# Altium project nnts.PrjPcb (part 3 of 3)

## Sheet Ethernet_PHY.SchDoc: Ethernet PHY
size A4; Revision: 1
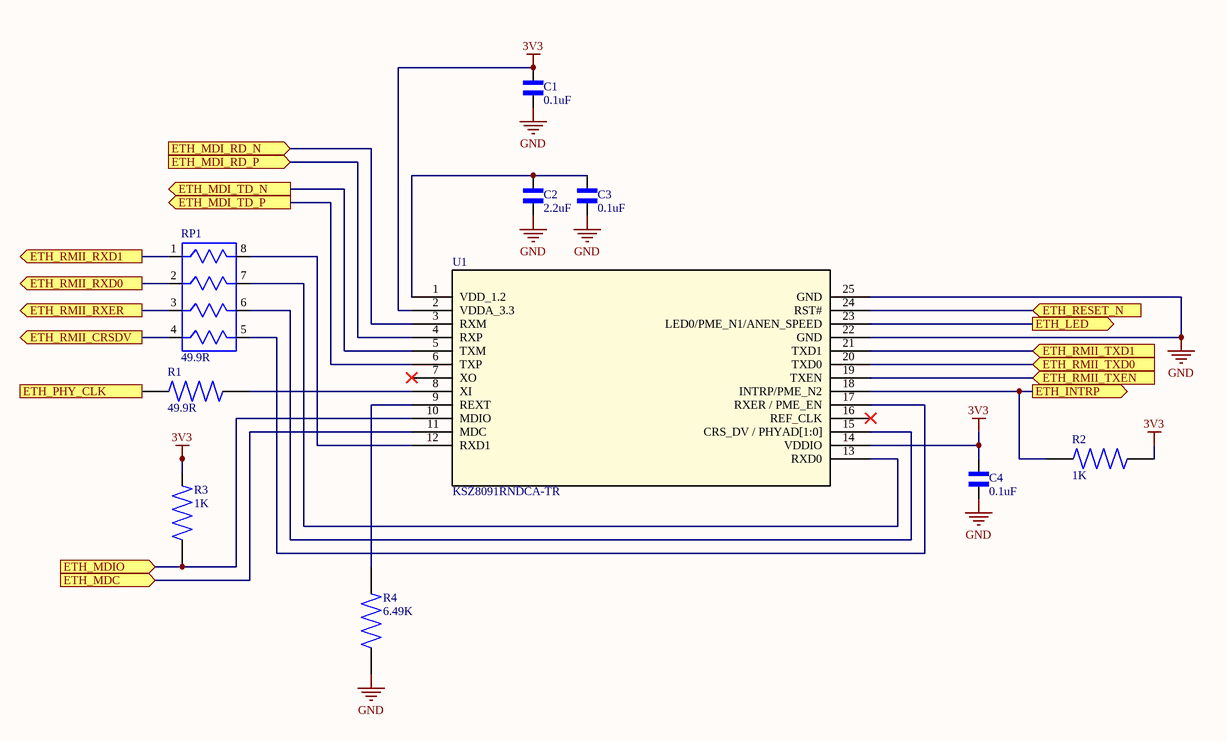
[diagram p9: Ethernet_PHY.SchDoc]

### Parts
C1  0.1uF  [C0402]
C2  2.2uF  [C0603]
C3  0.1uF  [C0402]
C4  0.1uF  [C0402]
R1  49.9R  [R0402 Vishay]
R2  1K  [R0603 Vishay]
R3  1K  [R0603 Vishay]
R4  6.49K  [R0603 Vishay]
RP1  49.9R  [RESCAXS50P200X100X55-8N]
U1  KSZ8091RNDCA-TR  [QFN50P400X400X90-25N]

### Ports
ETH_INTRP (out), ETH_LED (out), ETH_MDC (in), ETH_MDI_RD_N (in), ETH_MDI_RD_P (in), ETH_MDI_TD_N (out), ETH_MDI_TD_P (out), ETH_MDIO (in), ETH_PHY_CLK (in), ETH_RESET_N (in), ETH_RMII_CRSDV (out), ETH_RMII_RXD0 (out), ETH_RMII_RXD1 (out), ETH_RMII_RXER (out), ETH_RMII_TXD0 (in), ETH_RMII_TXD1 (in), ETH_RMII_TXEN (in)

### Nets
3V3: C1.2 C4.2 R2.1 R3.2 U1.2(VDDA_3.3) U1.14(VDDIO)
GND: C1.1 C2.1 C3.1 C4.1 R4.1 U1.22(GND) U1.25(GND)
NetC2_2: C2.2 C3.2 U1.1(VDD_1.2)
NetD1_11: U1.3(RXM) ; port ETH_MDI_RD_N
NetD1_12: U1.4(RXP) ; port ETH_MDI_RD_P
NetD1_13: U1.5(TXM) ; port ETH_MDI_TD_N
NetD1_14: U1.6(TXP) ; port ETH_MDI_TD_P
NetR1_1: R1.1 ; port ETH_PHY_CLK
NetR1_2: R1.2 U1.8(XI)
NetR2_2: R2.2 U1.18(INTRP/PME_N2) ; port ETH_INTRP
NetR3_1: R3.1 U1.10(MDIO) ; port ETH_MDIO
NetR4_2: R4.2 U1.9(REXT)
NetR9_1: U1.23(LED0/PME_N1/ANEN_SPEED) ; port ETH_LED
NetRP1_1: RP1.1 ; port ETH_RMII_RXD1
NetRP1_2: RP1.2 ; port ETH_RMII_RXD0
NetRP1_3: RP1.3 ; port ETH_RMII_RXER
NetRP1_4: RP1.4 ; port ETH_RMII_CRSDV
NetRP1_5: RP1.5 U1.17(RXER_/_PME_EN)
NetRP1_6: RP1.6 U1.15(CRS_DV_/_PHYAD[1:0])
NetRP1_7: RP1.7 U1.13(RXD0)
NetRP1_8: RP1.8 U1.12(RXD1)
NetU1_11: U1.11(MDC) ; port ETH_MDC
NetU1_19: U1.19(TXEN) ; port ETH_RMII_TXEN
NetU1_20: U1.20(TXD0) ; port ETH_RMII_TXD0
NetU1_21: U1.21(TXD1) ; port ETH_RMII_TXD1
NetU1_24: U1.24(RST#) ; port ETH_RESET_N

Not connected (* = marked no-connect by the designer): U1 7(XO)* 16(REF_CLK)*

### Library data of the parts
C1 C3 C4 = GRM022R60J104KE15L: CAP CER 0.1UF 6.3V X5R 01005; Manufacturer: Murata; Capacitance: 100nF; Tolerance: 10%; Supplier 1: Digi-Key; Manufacturer Part Number: GRM022R60J104KE15L; RoHS: No; Category: Ceramic Capacitors; Stock 1: 633064; Pricing 1: 1=0.13000, 10=0.09000, 50=0.05080, 100=0.04210, 500=0.02952, 1000=0.02444, 2500=0.02275, 5000=0.02081 (USD); Mount: Surface Mount; Case Code (Imperial): 1005; Case Code (Metric): 0402; Min Operating Temperature: -55°C; Max Operating Temperature: 85°C; Packaging: Cut Tape; Voltage Rating: 6.3V; ComponentLink1URL: http://search.murata.co.jp/Ceramy/image/img/A01X/G101/ENG/GRM022R60J104KE15-01.pdf?src-supplier=Digi-Key; ComponentLink1Description: http://search.murata.co.jp/Ceramy/image/img/A01X/G101/ENG/GRM022R60J104KE15-01.pdf?src-supplier=Digi-Key; Supplier Part Number 1: 490-16598-1-ND
C2 = LMK107BJ225KK-T: Cap Ceramic 2.2uF 10V X5R 10% Pad SMD 0603 85C T/R; Manufacturer: Taiyo Yuden; Supplier 1: Digi-Key; Manufacturer Part Number: LMK107BJ225KK-T; RoHS: No; Category: Ceramic Capacitors; Stock 1: 4228; Pricing 1: 1=0.17000, 10=0.11900, 50=0.06760, 100=0.05600, 500=0.03926, 1000=0.03250 (USD); ComponentLink1URL: http://www.farnell.com/datasheets/2801359.pdf?src-supplier=Newark; ComponentLink1Description: http://www.farnell.com/datasheets/2801359.pdf?src-supplier=Newark; Supplier Part Number 1: 587-6290-1-ND
R1 = CRCW040249R9FKTD: RES SMD 49.9 OHM 1% 1/16W 0402; Manufacturer: Vishay; Power Rating: 63mW; Temperature Coefficient: 100ppm/°C; Voltage Rating: 50V; Supplier 1: Digi-Key; Manufacturer Part Number: CRCW040249R9FKTD; RoHS: Yes; Category: Chip SMD Resistors; Stock 1: 2971; Pricing 1: 1=0.12000, 10=0.10900, 100=0.04200, 1000=0.01848, 2500=0.01596, 5000=0.01428 (USD); Case/Package: 0402; Contact Plating: Tin,Lead; Weight: 2.3E-05oz; Case Code (Metric): 1005; Case Code (Imperial): 0402; Min Operating Temperature: -55°C; Max Operating Temperature: 155°C; Resistance: 49.9R; Tolerance: 1%; Resistor Type: Thick Film; Packaging: Tape and Reel; Package Quantity: 10000; Number of Terminations: 2; Max Power Dissipation: 63mW; Voltage Rating (DC): 50V; Features: Automotive AEC-Q200; Length: 1mm; Width: 0.02inch; Height: 0.016inch; Depth: 0.5mm; Radiation Hardening: No; Lead Free: Contains Lead; Military Standard: Not; REACH SVHC: Unknown; ComponentLink1URL: https://datasheet.ciiva.com/2563/dcrcw-2563534.pdf?src-supplier=Digi-Key; ComponentLink1Description: https://datasheet.ciiva.com/2563/dcrcw-2563534.pdf?src-supplier=Digi-Key; Supplier Part Number 1: 541-2963-1-ND
R2 R3 = CRCW02011K00FNED: Res Thick Film 0201 1K Ohm 1% 1/20W 200ppm/C Molded SMD SMD Paper T/R; Manufacturer: Vishay; Resistance: 1kR; Power Rating: 50mW; Voltage Rating: 30V; Temperature Coefficient: 200ppm/°C; Supplier 1: Digi-Key; Manufacturer Part Number: CRCW02011K00FNED; RoHS: Yes; Category: Chip SMD Resistors; Stock 1: 279214; Pricing 1: 1=0.10000, 10=0.05700, 100=0.02300, 1000=0.01034, 2500=0.00897, 5000=0.00741 (USD); Mount: Surface Mount; Case/Package: 0201; Number of Pins: 2; Weight: 6E-06oz; Case Code (Metric): 0603; Case Code (Imperial): 0201; Contact Plating: Tin; Min Operating Temperature: -55°C; Max Operating Temperature: 155°C; Packaging: Tape and Reel; Tolerance: 1%; Package Quantity: 1; Resistor Type: Thick Film; Number of Terminations: 2; Termination: SMD/SMT; Max Power Dissipation: 50mW; Voltage Rating (DC): 30V; Length: 0.6mm; Width: 0.012inch; Height: 0.011inch; Depth: 0.3mm; Radiation Hardening: No; REACH SVHC: Unknown; Military Standard: Not; Lead Free: Lead Free; ComponentLink1URL: https://datasheet.ciiva.com/2474/crcw0201e3-2474800.pdf?src-supplier=Digi-Key; ComponentLink1Description: https://datasheet.ciiva.com/2474/crcw0201e3-2474800.pdf?src-supplier=Digi-Key; ComponentLink2URL: https://datasheet.ciiva.com/2474/crcw0201e3-2474802.pdf?src-supplier=Digi-Key; ComponentLink2Description: https://datasheet.ciiva.com/2474/crcw0201e3-2474802.pdf?src-supplier=Digi-Key; ComponentLink3URL: https://datasheet.ciiva.com/22665/1825492-22665818.pdf?src-supplier=Element14; ComponentLink3Description: https://datasheet.ciiva.com/22665/1825492-22665818.pdf?src-supplier=Element14; ComponentLink4URL: https://datasheet.ciiva.com/7983/1719906-7983323.pdf?src-supplier=Element14; ComponentLink4Description: https://datasheet.ciiva.com/7983/1719906-7983323.pdf?src-supplier=Element14; ComponentLink5URL: https://datasheet.ciiva.com/7983/1719906-7983324.pdf?src-supplier=Element14; ComponentLink5Description: https://datasheet.ciiva.com/7983/1719906-7983324.pdf?src-supplier=Element14; ComponentLink6URL: https://datasheet.ciiva.com/2474/crcw0201e3-2474801.pdf?src-supplier=Digi-Key; ComponentLink6Description: https://datasheet.ciiva.com/2474/crcw0201e3-2474801.pdf?src-supplier=Digi-Key; ComponentLink7URL: https://datasheet.ciiva.com/3255/crcw0201e3-3255929.pdf?src-supplier=Avnet; ComponentLink7Description: https://datasheet.ciiva.com/3255/crcw0201e3-3255929.pdf?src-supplier=Avnet; ComponentLink8URL: https://datasheet.ciiva.com/22871/70202042-22871422.pdf?src-supplier=Allied+Electronics; ComponentLink8Description: https://datasheet.ciiva.com/22871/70202042-22871422.pdf?src-supplier=Allied+Electronics; ComponentLink9URL: https://datasheet.ciiva.com/22692/1719906-22692751.pdf?src-supplier=Element14; ComponentLink9Description: https://datasheet.ciiva.com/22692/1719906-22692751.pdf?src-supplier=Element14; Supplier Part Number 1: 541-1.00KABCT-ND
R4 = CRCW02016K49FNED: RES SMD 6.49K OHM 1% 1/20W 0201; Manufacturer: Vishay; Power Rating: 50mW; Voltage Rating: 30V; Resistance: 6.49kR; Temperature Coefficient: 200ppm/°C; Supplier 1: Digi-Key; Manufacturer Part Number: CRCW02016K49FNED; RoHS: Yes; Category: Chip SMD Resistors; Stock 1: 4970; Pricing 1: 1=0.10000, 10=0.05700, 100=0.02300, 1000=0.01034, 2500=0.00897, 5000=0.00741 (USD); Case/Package: 0201; Case Code (Metric): 0603; Case Code (Imperial): 0201; Contact Plating: Tin; Min Operating Temperature: -55°C; Max Operating Temperature: 155°C; Tolerance: 1%; Packaging: Cut Tape; Resistor Type: Thick Film; Voltage Rating (DC): 30V; Length: 600um; Width: 300um; Height: 230um; REACH SVHC: Unknown; Lead Free: Lead Free; ComponentLink1URL: https://datasheet.ciiva.com/22684/1700795-22684054.pdf?src-supplier=Element14; ComponentLink1Description: https://datasheet.ciiva.com/22684/1700795-22684054.pdf?src-supplier=Element14; ComponentLink2URL: https://datasheet.ciiva.com/9062/crcw0201e3-9062251.pdf?src-supplier=Avnet; ComponentLink2Description: https://datasheet.ciiva.com/9062/crcw0201e3-9062251.pdf?src-supplier=Avnet; Supplier Part Number 1: 541-CRCW02016K49FNEDCT-ND
RP1 = YC124-FR-0749R9L: Res Thick Film Array 49.9 Ohm 1% 200ppm/C ISOL Molded 8-Pin 0804(4 X 0402) Convex SMD Paper T/R; Manufacturer: Yageo; Number of Terminals/Pins: 8; Temperature Coefficient: 200ppm/°C; Number of Resistors: 4; Circuit Type: Isolated; Power Per Element: 62.5mW; Working Voltage: 50V; Supplier 1: Digi-Key; Manufacturer Part Number: YC124-FR-0749R9L; RoHS: Yes; Category: Resistor Arrays; Stock 1: 76594; Pricing 1: 1=0.35000, 10=0.29700, 25=0.21560, 50=0.15640, 100=0.11590, 250=0.08896, 500=0.07010, 1000=0.04853, 5000=0.04044 (USD); Mount: Surface Mount; Case/Package: 0402; Number of Pins: 8; Min Operating Temperature: -55°C; Max Operating Temperature: 155°C; Resistance: 49.9R; Termination: Convex; Power Dissipation: 62.5mW; Number of Elements: 4; Tolerance: 1%; Package Quantity: 1; Packaging: Tape and Reel; Number of Circuits: 4; Length: 0.079inch; Width: 0.039inch; Height: 0.022inch; Terminal Pitch: 0.5mm; Depth: 1mm; Radiation Hardening: No; Military Standard: Not; Lead Free: Lead Free; ComponentLink1URL: https://datasheet.ciiva.com/2689/pyu-yc-tc124-51-rohs-l-3-2689456.pdf?src-supplier=Digi-Key; ComponentLink1Description: https://datasheet.ciiva.com/2689/pyu-yc-tc124-51-rohs-l-3-2689456.pdf?src-supplier=Digi-Key; ComponentLink2URL: https://datasheet.ciiva.com/28381/pyu-yc-tc124-51-rohs-l-2-28381383.pdf?src-supplier=Avnet+Europe; ComponentLink2Description: https://datasheet.ciiva.com/28381/pyu-yc-tc124-51-rohs-l-2-28381383.pdf?src-supplier=Avnet+Europe; ComponentLink3URL: https://datasheet.ciiva.com/16961/pyu-yc-tc124-51-rohs-l-2-16961496.pdf?src-supplier=Avnet+Europe; ComponentLink3Description: https://datasheet.ciiva.com/16961/pyu-yc-tc124-51-rohs-l-2-16961496.pdf?src-supplier=Avnet+Europe; ComponentLink4URL: https://datasheet.ciiva.com/17470/pyu-yc-tc124-51-rohs-l-3-17470984.pdf?src-supplier=Future+Electronics; ComponentLink4Description: https://datasheet.ciiva.com/17470/pyu-yc-tc124-51-rohs-l-3-17470984.pdf?src-supplier=Future+Electronics; ComponentLink5URL: https://datasheet.ciiva.com/2689/pyu-yc-tc124-51-rohs-l-3-2689454.pdf?src-supplier=Digi-Key; ComponentLink5Description: https://datasheet.ciiva.com/2689/pyu-yc-tc124-51-rohs-l-3-2689454.pdf?src-supplier=Digi-Key; ComponentLink6URL: https://datasheet.ciiva.com/2689/pyu-yc-tc124-51-rohs-l-3-2689455.pdf?src-supplier=Digi-Key; ComponentLink6Description: https://datasheet.ciiva.com/2689/pyu-yc-tc124-51-rohs-l-3-2689455.pdf?src-supplier=Digi-Key; ComponentLink7URL: https://datasheet.ciiva.com/8311/pyu-yc-tc124-51-rohs-l-2-8311759.pdf?src-supplier=Avnet; ComponentLink7Description: https://datasheet.ciiva.com/8311/pyu-yc-tc124-51-rohs-l-2-8311759.pdf?src-supplier=Avnet; Supplier Part Number 1: YC124F-49.9CT-ND
U1 = KSZ8091RNDCA-TR: 10/100 Base-Tx Physical Layer Transceiver, Eee, Wol / 24 Vqfn 4X4X0.9Mm T/r; Vendor: Microchip; Built_By: EMA_Cory; SourceLibrary: Microchip_2020-10-12; Datasheet: https://ww1.microchip.com/downloads/en/DeviceDoc/00002298A.pdf; Manufacturer_Part_Number: KSZ8091RNDCA-TR; Copyright: Copyright (C) 2018 Accelerated Designs. All rights reserved; RefDes: RefDes; Type: DEV

## Sheet EFM32_2.SchDoc: EFM_G11 MCU
size B; Revision: 1
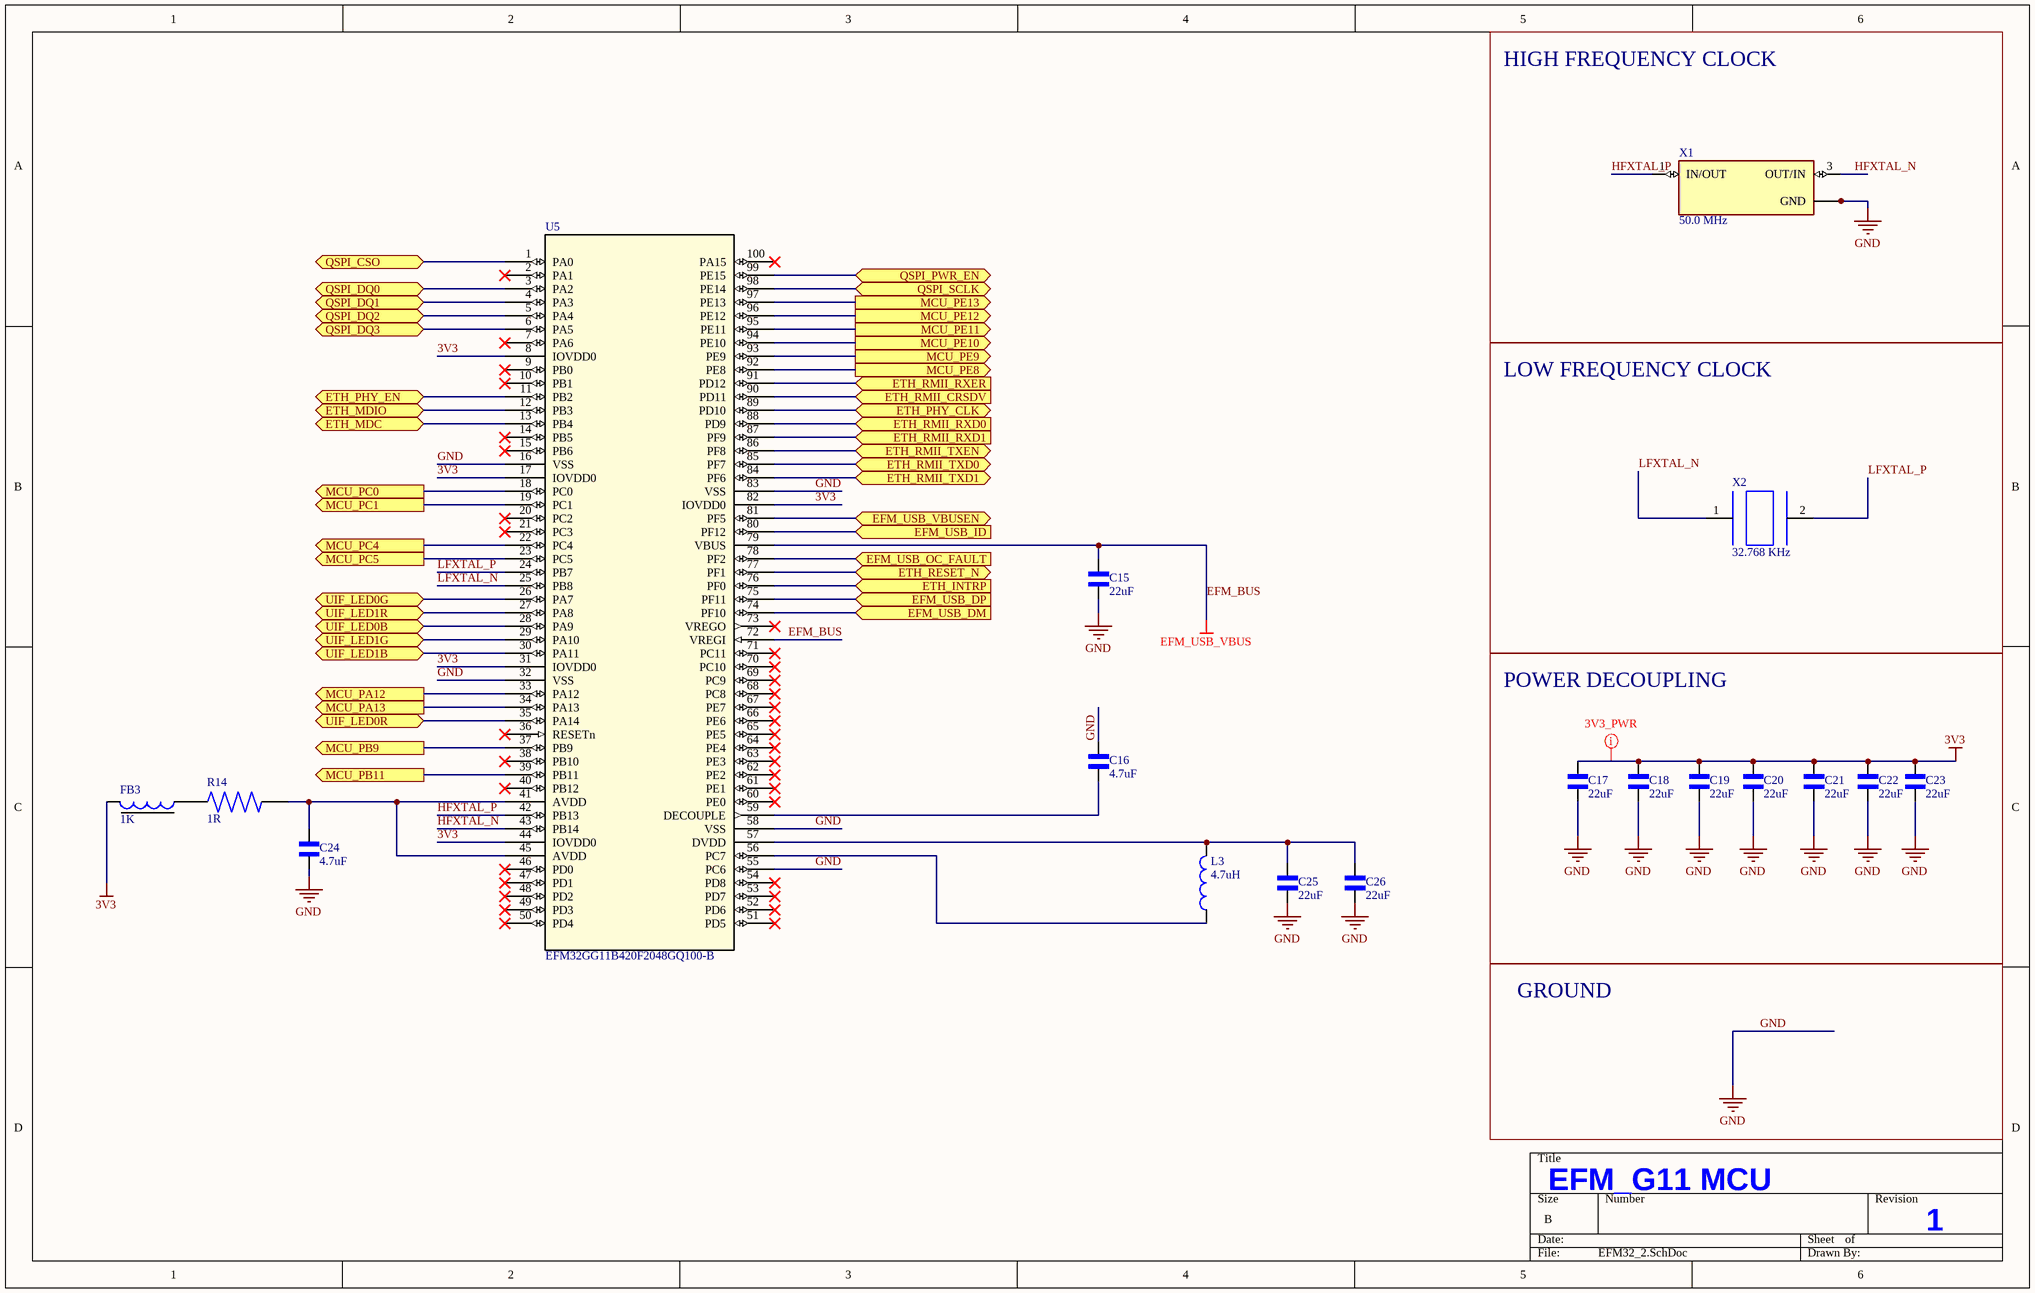
[diagram p10: EFM32_2.SchDoc]

### Parts
C15  22uF  [C0603]
C16  4.7uF  [C0603]
C17  22uF  [C0603]
C18  22uF  [C0603]
C19  22uF  [C0603]
C20  22uF  [C0603]
C21  22uF  [C0603]
C22  22uF  [C0603]
C23  22uF  [C0603]
C24  4.7uF  [C0603]
C25  22uF  [C0603]
C26  22uF  [C0603]
FB3  1K  [FB0402]
L3  4.7uH  [L0805]
R14  1R  [R0402 Vishay]
U5  EFM32GG11B420F2048GQ100-B  [TQFP100-14X14-0p]
X1  50.0 MHz  [XTAL_ECS-500-8-47B-CWY-TR]
X2  32.768 KHz  [XTAL_FC-135_32.7680KA-A0]

### Blocks framed on the sheet
HIGH FREQUENCY CLOCK: X1
LOW FREQUENCY CLOCK: X2
POWER DECOUPLING: C17-C23

### Ports
EFM_USB_DM (in), EFM_USB_DP (in), EFM_USB_ID (in), EFM_USB_OC_FAULT (in), EFM_USB_VBUSEN (bidir), ETH_INTRP (in), ETH_MDC (bidir), ETH_MDIO (bidir), ETH_PHY_CLK (bidir), ETH_PHY_EN (bidir), ETH_RESET_N (bidir), ETH_RMII_CRSDV (in), ETH_RMII_RXD0 (in), ETH_RMII_RXD1 (in), ETH_RMII_RXER (in), ETH_RMII_TXD0 (bidir), ETH_RMII_TXD1 (bidir), ETH_RMII_TXEN (bidir), MCU_PA12 (out), MCU_PA13 (out), MCU_PB9 (out), MCU_PB11 (out), MCU_PC0 (out), MCU_PC1 (out), MCU_PC4 (out), MCU_PC5 (out), MCU_PE8 (out), MCU_PE9 (out), MCU_PE10 (out), MCU_PE11 (out), MCU_PE12 (out), MCU_PE13 (out), QSPI_CSO (bidir), QSPI_DQ0 (bidir), QSPI_DQ1 (bidir), QSPI_DQ2 (bidir), QSPI_DQ3 (bidir), QSPI_PWR_EN (bidir), QSPI_SCLK (bidir), UIF_LED0B (bidir), UIF_LED0G (bidir), UIF_LED0R (bidir), UIF_LED1B (bidir), UIF_LED1G (bidir), UIF_LED1R (bidir)

### Nets
3V3: C17.2 C18.2 C19.1 C20.1 C21.1 C22.1 C23.1 FB3.2 U5.8(IOVDD0) U5.17(IOVDD0) U5.31(IOVDD0) U5.44(IOVDD0) U5.82(IOVDD0)
EFM_BUS: C15.2 U5.72(VREGI) U5.79(VBUS)  [also labelled EFM_USB_VBUS]
GND: C15.1 C16.1 C17.1 C18.1 C19.2 C20.2 C21.2 C22.2 C23.2 C24.1 C25.2 C26.2 U5.16(VSS) U5.32(VSS) U5.55(PC6) U5.58(VSS) U5.83(VSS) X1.2(GND) X1.4(GND)
HFXTAL_N: U5.43(PB14) X1.3(OUT/IN)
HFXTAL_P: U5.42(PB13) X1.1(IN/OUT)
LFXTAL_N: U5.25(PB8) X2.1
LFXTAL_P: U5.24(PB7) X2.2
NetC16_2: C16.2 U5.59(DECOUPLE)
NetC24_2: C24.2 R14.1 U5.41(AVDD) U5.45(AVDD)
NetC25_1: C25.1 C26.1 L3.2 U5.57(DVDD)
NetD3_1: U5.80(PF12) ; port EFM_USB_ID
NetL3_1: L3.1 U5.56(PC7)
NetP2_3: U5.33(PA12) ; port MCU_PA12
NetP2_4: U5.94(PE10) ; port MCU_PE10
NetP2_5: U5.34(PA13) ; port MCU_PA13
NetP2_6: U5.95(PE11) ; port MCU_PE11
NetP2_7: U5.22(PC4) ; port MCU_PC4
NetP2_8: U5.96(PE12) ; port MCU_PE12
NetP2_9: U5.23(PC5) ; port MCU_PC5
NetP2_10: U5.97(PE13) ; port MCU_PE13
NetP2_11: U5.39(PB11) ; port MCU_PB11
NetP2_12: U5.92(PE8) ; port MCU_PE8
NetP2_13: U5.37(PB9) ; port MCU_PB9
NetP2_14: U5.93(PE9) ; port MCU_PE9
NetP2_15: U5.19(PC1) ; port MCU_PC1
NetP2_16: U5.18(PC0) ; port MCU_PC0
NetR1_1: U5.89(PD10) ; port ETH_PHY_CLK
NetR2_2: U5.76(PF0) ; port ETH_INTRP
NetR3_1: U5.12(PB3) ; port ETH_MDIO
NetR10_2: U5.11(PB2) ; port ETH_PHY_EN
NetR11_1: U5.1(PA0) ; port QSPI_CSO
NetR12_2: U5.98(PE14) ; port QSPI_SCLK
NetR13_2: U5.99(PE15) ; port QSPI_PWR_EN
NetR15_2: U5.75(PF11) ; port EFM_USB_DP
NetR16_2: U5.74(PF10) ; port EFM_USB_DM
NetR17_1: U5.81(PF5) ; port EFM_USB_VBUSEN
NetR18_2: U5.78(PF2) ; port EFM_USB_OC_FAULT
NetR22_1: U5.26(PA7) ; port UIF_LED0G
NetR23_1: U5.29(PA10) ; port UIF_LED1G
NetR24_1: U5.35(PA14) ; port UIF_LED0R
NetR25_1: U5.27(PA8) ; port UIF_LED1R
NetR26_1: U5.28(PA9) ; port UIF_LED0B
NetR27_1: U5.30(PA11) ; port UIF_LED1B
NetRP1_1: U5.87(PF9) ; port ETH_RMII_RXD1
NetRP1_2: U5.88(PD9) ; port ETH_RMII_RXD0
NetRP1_3: U5.91(PD12) ; port ETH_RMII_RXER
NetRP1_4: U5.90(PD11) ; port ETH_RMII_CRSDV
NetRP2_1: U5.6(PA5) ; port QSPI_DQ3
NetRP2_2: U5.5(PA4) ; port QSPI_DQ2
NetRP2_3: U5.4(PA3) ; port QSPI_DQ1
NetRP2_4: U5.3(PA2) ; port QSPI_DQ0
NetU1_11: U5.13(PB4) ; port ETH_MDC
NetU1_19: U5.86(PF8) ; port ETH_RMII_TXEN
NetU1_20: U5.85(PF7) ; port ETH_RMII_TXD0
NetU1_21: U5.84(PF6) ; port ETH_RMII_TXD1
NetU1_24: U5.77(PF1) ; port ETH_RESET_N

Not connected (* = marked no-connect by the designer): FB3 1; R14 2; U5 2(PA1)* 7(PA6)* 9(PB0)* 10(PB1)* 14(PB5)* 15(PB6)* 20(PC2)* 21(PC3)* 36(RESETn)* 38(PB10)* 40(PB12)* 46(PD0)* 47(PD1)* 48(PD2)* 49(PD3)* 50(PD4)* 51(PD5)* 52(PD6)* 53(PD7)* 54(PD8)* 60(PE0)* 61(PE1)* 62(PE2)* 63(PE3)* 64(PE4)* 65(PE5)* 66(PE6)* 67(PE7)* 68(PC8)* 69(PC9)* 70(PC10)* 71(PC11)* 73(VREGO)* 100(PA15)*

### Layout directives
rule Width Constraint [Pref Width = 20mil    Min Width = 6mil    Max Width = 100mil]: 3V3

### Notes on the sheet
- GROUND

### Library data of the parts
C15 C17-C23 C25 C26 = ZRB18AR61A226ME01L: 0603 22 uF 10 V ±20% Tolerance X5R Surface Mount Multilayer Ceramic Capacitor; Manufacturer: Murata; Voltage Rating: 10V; Supplier 1: Mouser; Manufacturer Part Number: ZRB18AR61A226ME01L; RoHS: No; Category: Ceramic Capacitors; Stock 1: 179696; Pricing 1: 1=0.44000, 10=0.30400, 100=0.18300, 500=0.13700, 1000=0.11600, 3000=0.09500 (USD); Mount: Surface Mount; Case/Package: 0603; Min Operating Temperature: -55°C; Max Operating Temperature: 85°C; Packaging: Tape and Reel; Capacitance: 22uF; Tolerance: 20%; ComponentLink1URL: http://search.murata.co.jp/Ceramy/image/img/A01X/G101/ENG/ZRB18AR61A226ME01-02.pdf?src-supplier=Digi-Key; ComponentLink1Description: http://search.murata.co.jp/Ceramy/image/img/A01X/G101/ENG/ZRB18AR61A226ME01-02.pdf?src-supplier=Digi-Key; Supplier Part Number 1: 81-ZRB18AR61A226ME1L
C16 C24 = CL10A475KP8NNNC: Cap Ceramic 4.7uF 10V X5R 10% Pad SMD 0603 85C T/R; Manufacturer: Samsung; Supplier 1: Digi-Key; Manufacturer Part Number: CL10A475KP8NNNC; RoHS: Yes; Category: Ceramic Capacitors; Stock 1: 274416; Pricing 1: 1=0.10000, 10=0.04800, 50=0.02620, 100=0.02140, 500=0.01528, 1000=0.01201 (USD); Mount: Surface Mount; Case/Package: 0603; Case Code (Imperial): 0603; Contact Plating: Tin; Case Code (Metric): 1608; Min Operating Temperature: -55°C; Max Operating Temperature: 85°C; Tolerance: 10%; Capacitance: 4.7uF; Dielectric: X5R; Package Quantity: 1; Packaging: Tape and Reel; Voltage Rating: 10V; Length: 1.6mm; Width: 0.031inch; Height: 0.8mm; Thickness: 0.035inch; Depth: 0.8mm; Radiation Hardening: No; ComponentLink1URL: https://datasheet.ciiva.com/25797/cl10a475kp8nnnc-25797520.pdf?src-supplier=Digi-Key; ComponentLink1Description: https://datasheet.ciiva.com/25797/cl10a475kp8nnnc-25797520.pdf?src-supplier=Digi-Key; ComponentLink2URL: https://datasheet.ciiva.com/26838/getdatasheetpartid-358676-26838384.pdf?src-supplier=Verical; ComponentLink2Description: https://datasheet.ciiva.com/26838/getdatasheetpartid-358676-26838384.pdf?src-supplier=Verical; ComponentLink3URL: https://datasheet.ciiva.com/16318/cl05b104kq5nnnc-16318245.pdf?src-supplier=Future+Electronics; ComponentLink3Description: https://datasheet.ciiva.com/16318/cl05b104kq5nnnc-16318245.pdf?src-supplier=Future+Electronics; Supplier Part Number 1: 1276-1044-1-ND
FB3 = BLM15AG102SH1D: FERRITE BEAD 1 KOHM 0402 1LN; Manufacturer: Murata; Impedance: 1kR; Tolerance: 25%; Max DC Current: 200mA; DC Resistance (DCR): 1R; Test Frequency: 100MHz; Number of Lines: 1; Supplier 1: Digi-Key; Manufacturer Part Number: BLM15AG102SH1D; RoHS: Yes; Category: Ferrite Beads and Chips; Stock 1: 79326; Pricing 1: 1=0.11000, 10=0.09300, 25=0.08320, 50=0.06100, 100=0.05270, 250=0.04164, 500=0.03516, 1000=0.02960, 5000=0.02636 (USD); Mount: Surface Mount; Case/Package: 0402; Core Material: Ferrite; Case Code (Metric): 1005; Case Code (Imperial): 0402; Min Operating Temperature: -55°C; Max Operating Temperature: 125°C; Packaging: Tape and Reel; Package Quantity: 10000; Termination: SMD/SMT; Max Current Rating: 200mA; Number of Circuits: 1; Length: 0.039inch; Width: 0.5mm; Height: 0.022inch; Depth: 0.55mm; Ratings: AEC-Q200; REACH SVHC: No SVHC; ComponentLink1URL: https://datasheet.ciiva.com/29364/l0132s0193blm15a-sh-29364285.pdf?src-supplier=Digi-Key; ComponentLink1Description: https://datasheet.ciiva.com/29364/l0132s0193blm15a-sh-29364285.pdf?src-supplier=Digi-Key; ComponentLink2URL: https://datasheet.ciiva.com/17279/l0132s0193blm15a-sh-17279626.pdf?src-supplier=Avnet+Europe; ComponentLink2Description: https://datasheet.ciiva.com/17279/l0132s0193blm15a-sh-17279626.pdf?src-supplier=Avnet+Europe; ComponentLink3URL: https://datasheet.ciiva.com/8510/l0132s0193blm15a-sh-8510171.pdf?src-supplier=Avnet; ComponentLink3Description: https://datasheet.ciiva.com/8510/l0132s0193blm15a-sh-8510171.pdf?src-supplier=Avnet; ComponentLink4URL: https://datasheet.ciiva.com/29364/l0132s0193blm15a-sh-29364283.pdf?src-supplier=Digi-Key; ComponentLink4Description: https://datasheet.ciiva.com/29364/l0132s0193blm15a-sh-29364283.pdf?src-supplier=Digi-Key; ComponentLink5URL: https://datasheet.ciiva.com/29364/l0132s0193blm15a-sh-29364286.pdf?src-supplier=Digi-Key; ComponentLink5Description: https://datasheet.ciiva.com/29364/l0132s0193blm15a-sh-29364286.pdf?src-supplier=Digi-Key; Supplier Part Number 1: 490-7804-1-ND
L3 = LQM21PN4R7MGRB: Inductor with Inductance: 4.7uH Tol. +/-20%, Package: 0805 (2012); MF: Murata; Availability: Bad; SnapEDA_Link: https://www.snapeda.com/parts/LQM21PN4R7MGRB/Murata/view-part/4470527/?ref=snap; MP: LQM21PN4R7MGRB; Value: *; Price: None; Package: 2012 Murata; Check_prices: https://www.snapeda.com/parts/LQM21PN4R7MGRB/Murata/view-part/4470527/?ref=eda
R14 = CRCW04021R00FNED: RES SMD 1 OHM 1% 1/16W 0402; Manufacturer: Vishay; Power Rating: 63mW; Voltage Rating: 50V; Temperature Coefficient: 200ppm/°C; Supplier 1: Digi-Key; Manufacturer Part Number: CRCW04021R00FNED; RoHS: Yes; Category: Chip SMD Resistors; Stock 1: 16685; Pricing 1: 1=0.10000, 10=0.05000, 100=0.02040, 1000=0.00914, 2500=0.00794, 5000=0.00656 (USD); Mount: Surface Mount; Case/Package: 0402; Number of Pins: 2; Weight: 2.3E-05oz; Case Code (Metric): 1005; Case Code (Imperial): 0402; Contact Plating: Tin; Min Operating Temperature: -55°C; Max Operating Temperature: 155°C; Resistance: 1R; Tolerance: 1%; Packaging: Tape and Reel; Package Quantity: 10000; Resistor Type: Thick Film; Number of Terminations: 2; Termination: SMD/SMT; Max Power Dissipation: 63mW; Voltage Rating (DC): 50V; Features: Automotive AEC-Q200; Length: 1mm; Width: 0.02inch; Height: 0.016inch; Depth: 0.5mm; Radiation Hardening: No; REACH SVHC: Unknown; Military Standard: Not; Lead Free: Lead Free; ComponentLink1URL: https://datasheet.ciiva.com/2560/dcrcwe3-2560101.pdf?src-supplier=Digi-Key; ComponentLink1Description: https://datasheet.ciiva.com/2560/dcrcwe3-2560101.pdf?src-supplier=Digi-Key; ComponentLink2URL: https://datasheet.ciiva.com/6027/1697337-6027861.pdf?src-supplier=Farnell; ComponentLink2Description: https://datasheet.ciiva.com/6027/1697337-6027861.pdf?src-supplier=Farnell; ComponentLink3URL: https://datasheet.ciiva.com/2560/dcrcwe3-2560102.pdf?src-supplier=Digi-Key; ComponentLink3Description: https://datasheet.ciiva.com/2560/dcrcwe3-2560102.pdf?src-supplier=Digi-Key; ComponentLink4URL: https://datasheet.ciiva.com/2560/dcrcwe3-2560103.pdf?src-supplier=Digi-Key; ComponentLink4Description: https://datasheet.ciiva.com/2560/dcrcwe3-2560103.pdf?src-supplier=Digi-Key; ComponentLink5URL: https://datasheet.ciiva.com/3256/dcrcwe3-3256199.pdf?src-supplier=Avnet; ComponentLink5Description: https://datasheet.ciiva.com/3256/dcrcwe3-3256199.pdf?src-supplier=Avnet; ComponentLink6URL: https://datasheet.ciiva.com/3256/dcrcwe3-3256200.pdf?src-supplier=Avnet; ComponentLink6Description: https://datasheet.ciiva.com/3256/dcrcwe3-3256200.pdf?src-supplier=Avnet; ComponentLink7URL: https://datasheet.ciiva.com/5552/dcrcwe3-109170-5552232.pdf?src-supplier=Mouser; ComponentLink7Description: https://datasheet.ciiva.com/5552/dcrcwe3-109170-5552232.pdf?src-supplier=Mouser; ComponentLink8URL: https://datasheet.ciiva.com/16436/dcrcwe3-16436173.pdf?src-supplier=Future+Electronics; ComponentLink8Description: https://datasheet.ciiva.com/16436/dcrcwe3-16436173.pdf?src-supplier=Future+Electronics; ComponentLink9URL: https://datasheet.ciiva.com/7841/125364-7841807.pdf?src-supplier=Element14; ComponentLink9Description: https://datasheet.ciiva.com/7841/125364-7841807.pdf?src-supplier=Element14; Supplier Part Number 1: 541-1.00LCT-ND
U5 = EFM32GG11B420F2048GQ100-B: MCU 32-bit ARM Cortex M4 RISC 2MB Flash 3.3V 100-Pin TQFP Tray; Manufacturer: Silicon Labs; Supplier 1: Mouser; Manufacturer Part Number: EFM32GG11B420F2048GQ100-B; RoHS: No; Stock 1: 140; Pricing 1: 1=9.00000, 10=8.84000, 25=8.69000, 50=8.52000, 100=8.35000, 250=8.34000, 500=8.32000, 1000=8.30000 (USD); Supplier Part Number 1: 634-B420F2048GQ100-B
X1 = ECS-500-8-47B-CWY-TR: CRYSTAL 50.0000MHZ 8PF SMD; MF: ECS Inc.; Price: None; Check_prices: https://www.snapeda.com/parts/ECS-500-8-47B-CWY-TR/ECS%20Inc./view-part/5049033/?ref=eda; SnapEDA_Link: https://www.snapeda.com/parts/ECS-500-8-47B-CWY-TR/ECS%20Inc./view-part/5049033/?ref=snap; Package: None; Purchase-URL: https://pricing.snapeda.com/search/part/ECS-500-8-47B-CWY-TR/?ref=eda; Availability: Warning; MP: ECS-500-8-47B-CWY-TR; Value: *
X2 = FC-135_32.7680KA-A0: 32.768kHz Â±20ppm Crystal 12.5pF 70 kOhms 2-SMD, No Lead; MP: FC-135 32.7680KA-A0; MF: EPSON; Package: SMD-2 Epson; SnapEDA_Link: https://www.snapeda.com/parts/FC-135%2032.7680KA-A0/EPSON/view-part/51409/?ref=snap; Availability: Unavailable; Value: *; Price: None

## Nets that join several sheets
3V3: Ethernet_Jack (D2.1), Ethernet_Switch (7 pins), Quad_SPI_Memory (C12.2 R11.2 U3.8), External_Memory_Power_Switch (9 pins), Power (5 pins), EXP_Headers (P2.2 P2.20), LED (LED1.1 LED2.1), Ethernet_PHY (6 pins), EFM32_2 (13 pins)
5V: USB (FB5.1), Power (5 pins), EXP_Headers (P2.18)
EFM_BUS: USB (C30.2 FB4.2 U6.1), EFM32_2 (C15.2 U5.72 U5.79)
GND: Ethernet_Jack (6 pins), Ethernet_Switch (5 pins), Quad_SPI_Memory (C12.1 U3.4), External_Memory_Power_Switch (C13.1 C14.1 R13.1 U4.7), USB (7 pins), Power (7 pins), EXP_Headers (P2.1), Ethernet_PHY (7 pins), EFM32_2 (19 pins)
NetD1_11: Ethernet_Jack (D1.11 T2.1), Ethernet_PHY (U1.3)
NetD1_12: Ethernet_Jack (D1.12 T2.2), Ethernet_PHY (U1.4)
NetD1_13: Ethernet_Jack (D1.13 T1.1), Ethernet_PHY (U1.5)
NetD1_14: Ethernet_Jack (D1.14 T1.2), Ethernet_PHY (U1.6)
NetD3_1: USB (D3.1 J1.4 TP1.1), EFM32_2 (U5.80)
NetP2_3: EXP_Headers (P2.3), EFM32_2 (U5.33)
NetP2_4: EXP_Headers (P2.4), EFM32_2 (U5.94)
NetP2_5: EXP_Headers (P2.5), EFM32_2 (U5.34)
NetP2_6: EXP_Headers (P2.6), EFM32_2 (U5.95)
NetP2_7: EXP_Headers (P2.7), EFM32_2 (U5.22)
NetP2_8: EXP_Headers (P2.8), EFM32_2 (U5.96)
NetP2_9: EXP_Headers (P2.9), EFM32_2 (U5.23)
NetP2_10: EXP_Headers (P2.10), EFM32_2 (U5.97)
NetP2_11: EXP_Headers (P2.11), EFM32_2 (U5.39)
NetP2_12: EXP_Headers (P2.12), EFM32_2 (U5.92)
NetP2_13: EXP_Headers (P2.13), EFM32_2 (U5.37)
NetP2_14: EXP_Headers (P2.14), EFM32_2 (U5.93)
NetP2_15: EXP_Headers (P2.15), EFM32_2 (U5.19)
NetP2_16: EXP_Headers (P2.16), EFM32_2 (U5.18)
NetR1_1: Ethernet_PHY (R1.1), EFM32_2 (U5.89)
NetR2_2: Ethernet_PHY (R2.2 U1.18), EFM32_2 (U5.76)
NetR3_1: Ethernet_PHY (R3.1 U1.10), EFM32_2 (U5.12)
NetR9_1: Ethernet_Jack (R9.1), Ethernet_PHY (U1.23)
NetR10_2: Ethernet_Switch (R10.2 U2.4), EFM32_2 (U5.11)
NetR11_1: Quad_SPI_Memory (R11.1 U3.1), EFM32_2 (U5.1)
NetR12_2: Quad_SPI_Memory (R12.2), EFM32_2 (U5.98)
NetR13_2: External_Memory_Power_Switch (R13.2 U4.6 U4.12), EFM32_2 (U5.99)
NetR15_2: USB (R15.2), EFM32_2 (U5.75)
NetR16_2: USB (R16.2), EFM32_2 (U5.74)
NetR17_1: USB (R17.1 U6.4), EFM32_2 (U5.81)
NetR18_2: USB (R18.2), EFM32_2 (U5.78)
NetR22_1: LED (R22.1), EFM32_2 (U5.26)
NetR23_1: LED (R23.1), EFM32_2 (U5.29)
NetR24_1: LED (R24.1), EFM32_2 (U5.35)
NetR25_1: LED (R25.1), EFM32_2 (U5.27)
NetR26_1: LED (R26.1), EFM32_2 (U5.28)
NetR27_1: LED (R27.1), EFM32_2 (U5.30)
NetRP1_1: Ethernet_PHY (RP1.1), EFM32_2 (U5.87)
NetRP1_2: Ethernet_PHY (RP1.2), EFM32_2 (U5.88)
NetRP1_3: Ethernet_PHY (RP1.3), EFM32_2 (U5.91)
NetRP1_4: Ethernet_PHY (RP1.4), EFM32_2 (U5.90)
NetRP2_1: Quad_SPI_Memory (RP2.1), EFM32_2 (U5.6)
NetRP2_2: Quad_SPI_Memory (RP2.2), EFM32_2 (U5.5)
NetRP2_3: Quad_SPI_Memory (RP2.3), EFM32_2 (U5.4)
NetRP2_4: Quad_SPI_Memory (RP2.4), EFM32_2 (U5.3)
NetU1_11: Ethernet_PHY (U1.11), EFM32_2 (U5.13)
NetU1_19: Ethernet_PHY (U1.19), EFM32_2 (U5.86)
NetU1_20: Ethernet_PHY (U1.20), EFM32_2 (U5.85)
NetU1_21: Ethernet_PHY (U1.21), EFM32_2 (U5.84)
NetU1_24: Ethernet_PHY (U1.24), EFM32_2 (U5.77)